# Altium schematic sheet Sheet1.SchDoc
size 594 x 420 mm; SheetNumber: 1; SheetTotal: 1
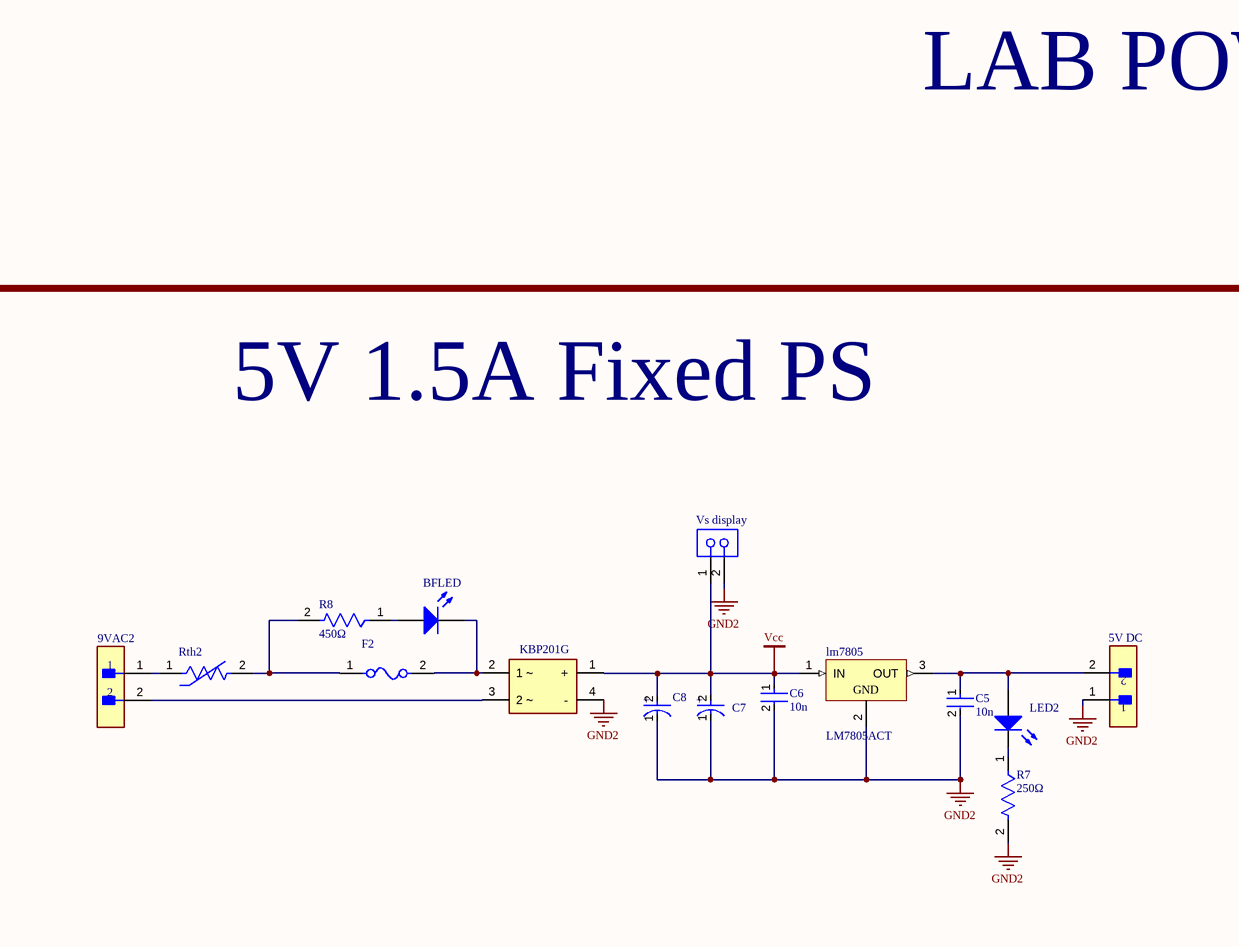
[diagram p0: Sheet1.SchDoc, top left]
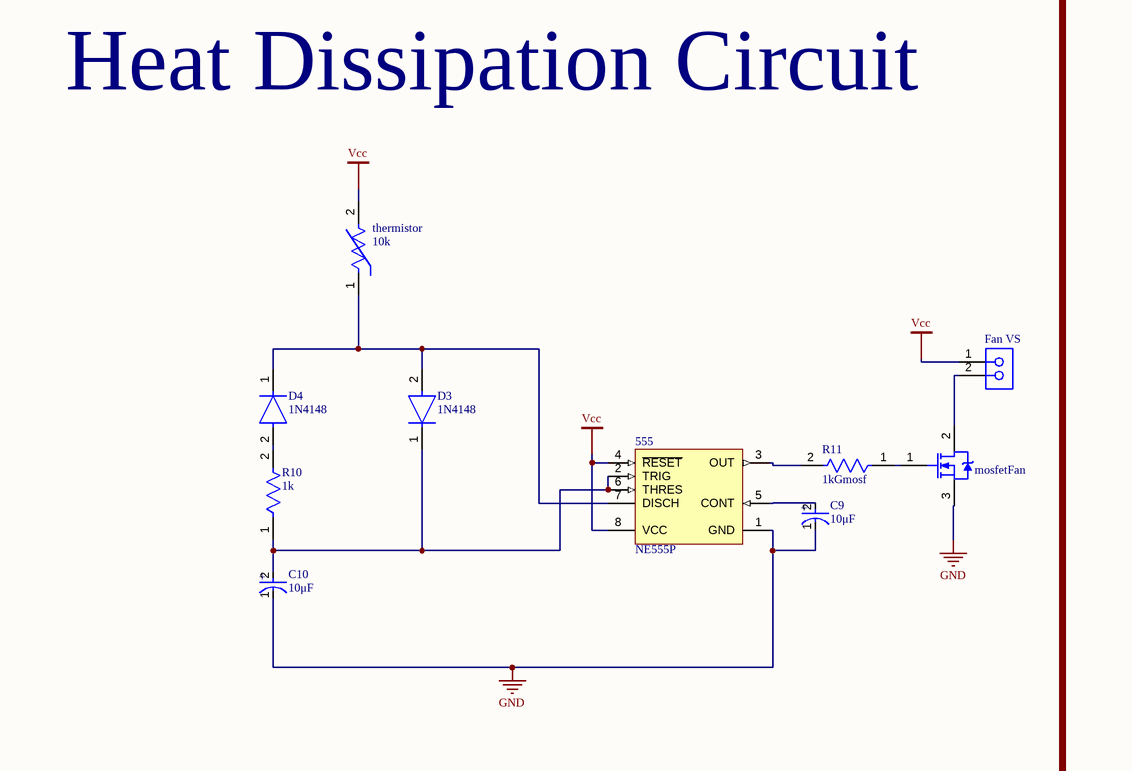
[diagram p1: Sheet1.SchDoc, top right]
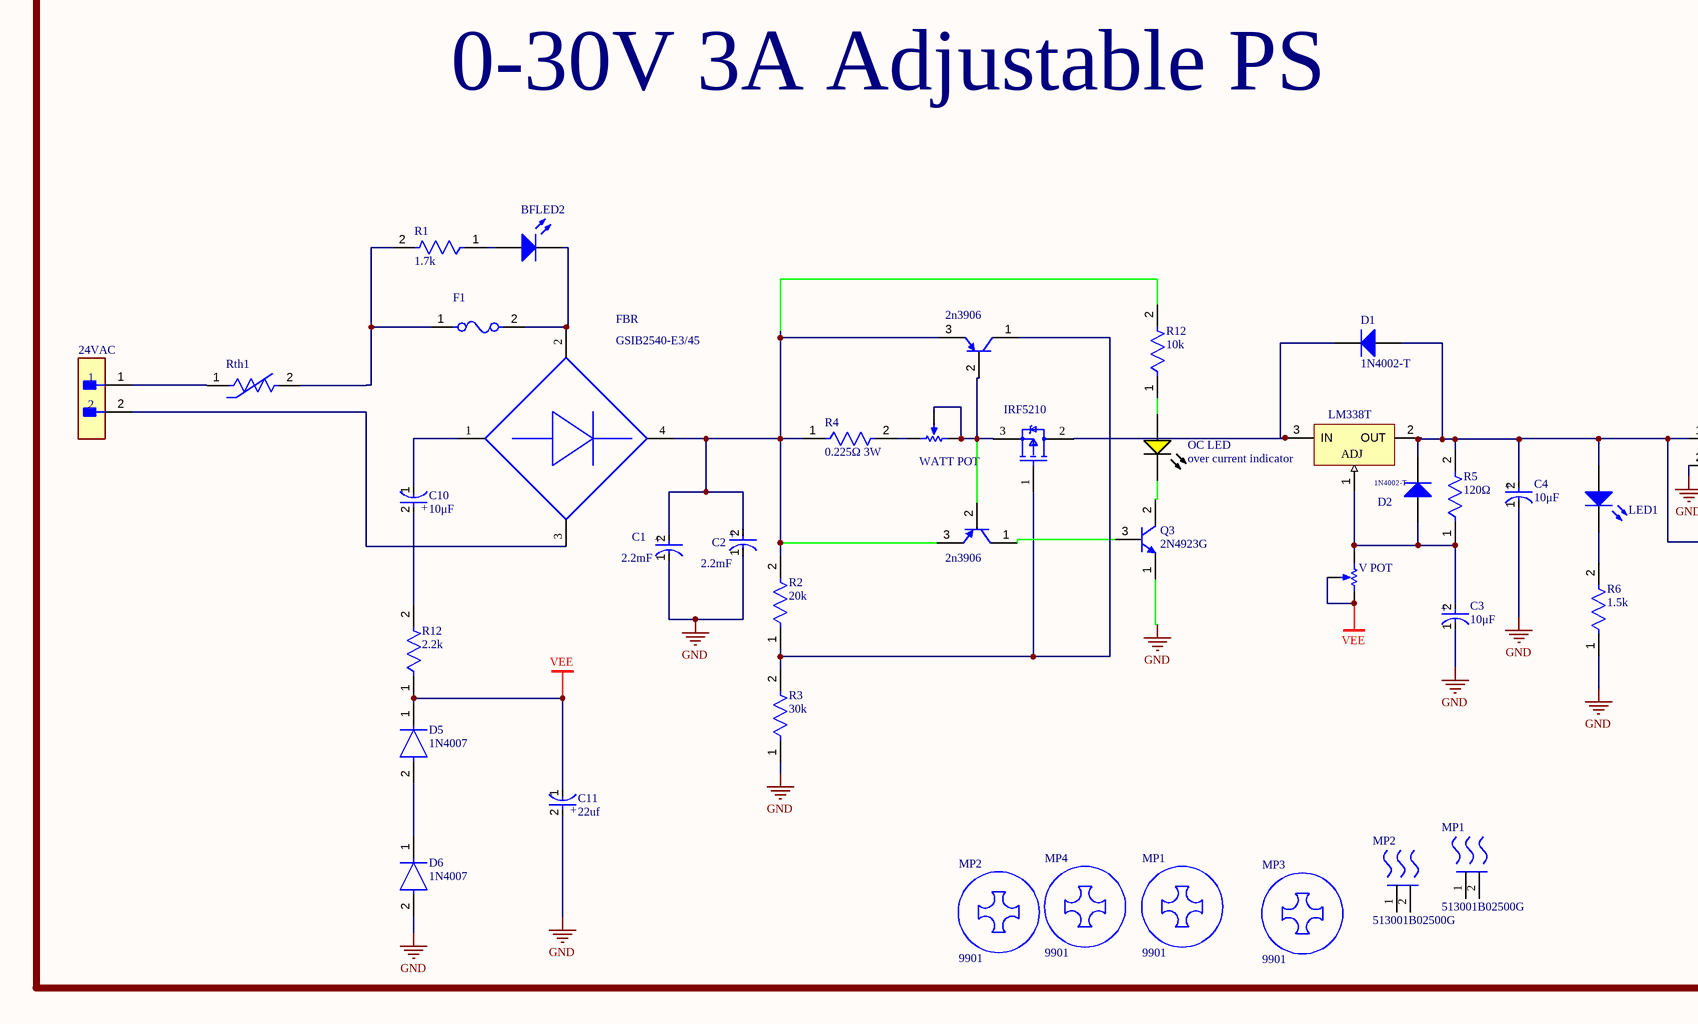
[diagram p2: Sheet1.SchDoc, bottom left]
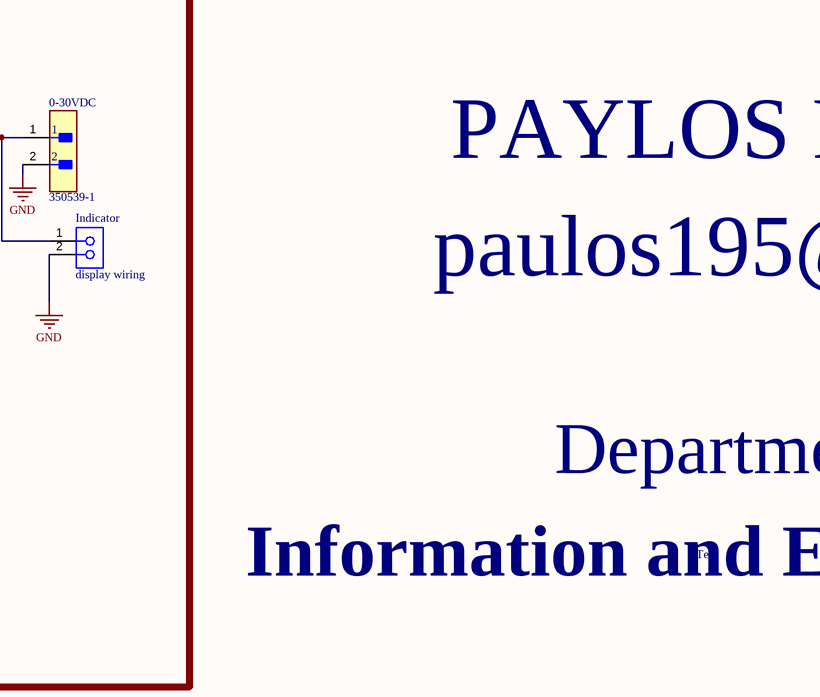
[diagram p3: Sheet1.SchDoc, bottom right]

## Parts
(Parts that share a designator on the sheet are numbered #1, #2 ... from top to bottom, then left to right.)
0-30VDC  350539-1  [FP-350539-1-MFG]
5V_DC  350539-1  [FP-350539-1-MFG]  (value not drawn)
9VAC2  350539-1  [FP-350539-1-MFG]  (value not drawn)
24VAC  350539-1  [FP-350539-1-MFG]  (value not drawn)
555  NE555P  [P0008A]
BFLED  Blowfuse indicator  [Type 3mm]  (value not drawn)
BFLED2  Blown fuse indicator  [Type 3mm]  (value not drawn)
C1  2.2mF  [FP-EGPA500ELL222ML40S-MFG]
C2  2.2mF  [FP-EGPA500ELL222ML40S-MFG]
C3  10μF  [FP-ECA-2CHG010I-MFG]
C4  10μF  [FP-ECA-2CHG010I-MFG]
C5  10n  [FP-RDE0M1-MFG]
C6  10n  [FP-RDE0M1-MFG]
C7  2.2mF  [FP-EGPA500ELL222ML40S-MFG]  (value not drawn)
C8  2.2mF  [FP-EGPA500ELL222ML40S-MFG]  (value not drawn)
C9  10μF  [FP-ECA-2CHG010I-MFG]
C10#1  10μF  [FP-ECA-2CHG010I-MFG]
C10#2  10μF  [FP-ECA-2CHG010I-MFG]
C11  22uf  [FP-RAD-TH-D_5_0_5-L_7_1-F-MFG]
D1  1N4002-T  [DIOD-DO-41-P-2_V]
D2  1N4002-T  [DIOD-DO-41-P-2_V]
D3  1N4148  [FP-017AG-MFG]
D4  1N4148  [FP-017AG-MFG]
D5  1N4007  [FP-1N4007-MFG]
D6  1N4007  [FP-1N4007-MFG]
D?  KBP201G  [FP-KBP-MFG]
F1  64600001223  [FP-64600001223-MFG]  (value not drawn)
F2  64600001223  [FP-64600001223-MFG]  (value not drawn)
Fan_VS  SSQ-102-01-G-S  [SMTC-SSQ-102-01-X-S]  (value not drawn)
FBR  GSIB2540-E3/45  [FP-GSIB2580-E3-45-MFG]
Indicator  display wiring  [SMTC-SSQ-102-01-X-S]
LED1  on indicator  [Type 3mm]  (value not drawn)
LED2  on indicator  [Type 3mm]  (value not drawn)
LM338  LM338T  [NDE0003A]
lm7805  LM7805ACT  [FAIR-TO-220-3]
mosfetCL  IRF5210  [FP-PG-TO262-3-MFG]
mosfetFan  IRF3205PBF  [INF-PG-TO-220AB]  (value not drawn)
MP1#1  513001B02500G  [FP-513001B02500G-MFG]
MP1#2  9901  [FP-9901-MFG]
MP2#1  9901  [FP-9901-MFG]
MP2#2  513001B02500G  [FP-513001B02500G-MFG]
MP3  9901  [FP-9901-MFG]
MP4  9901  [FP-9901-MFG]
OC_LED  over current indicator  [KING-WP7113SYD_V]
Q1  2n3906  [ONSC-TO-92-3-29-11_AM_BL]
Q2  2n3906  [ONSC-TO-92-3-29-11_AM_BL]
Q3  2N4923G  [ONSC-TO-225-3-77-09]
R1  1.7k  [FP-CF14-MFG]
R2  20k  [FP-CF14-MFG]
R3  30k  [FP-CF14-MFG]
R4  0.225Ω 3W  [FP-PAC03-MFG]
R5  120Ω  [FP-CF14-MFG]
R6  1.5k  [FP-CF14-MFG]
R7  250Ω  [FP-CF14-MFG]
R8  450Ω  [FP-CF14-MFG]
R10  1k  [FP-CF14-MFG]
R11  1kGmosf  [FP-CF14-MFG]
R12#1  10k  [FP-CF14-MFG]
R12#2  2.2k  [FP-CF14-MFG]
Rth1  NTPAA5R1LDNB0  [FP-NTPAA-MFG]  (value not drawn)
Rth2  NTPAA5R1LDNB0  [FP-NTPAA-MFG]  (value not drawn)
thermistor  10k  [FP-103AT-2-MFG]
V_POT  2.85k  [BOUR-3852A-282-103AL-3_V]  (value not drawn)
Vs_display  SSQ-102-01-G-S  [SMTC-SSQ-102-01-X-S]  (value not drawn)
WATT_POT  3852A-282-103AL  [BOUR-3852A-282-103AL-3_V]  (value not drawn)

## Blocks framed on the sheet
Heat Dissipation Circuit: 555 C9 C10#1 D3 D4 Fan_VS mosfetFan R10 R11 thermistor
5V 1.5A Fixed PS: 5V_DC 9VAC2 BFLED C5-C8 D? F2 LED2 lm7805 R7 R8 Rth2 Vs_display
0-30V 3A Adjustable PS: 0-30VDC 24VAC BFLED2 C1-C4 C10#2 C11 D1 D2 D5 D6 F1 FBR Indicator LED1 LM338 mosfetCL MP1#1 MP1#2 MP2#1 MP2#2 MP3 MP4 OC_LED Q1-Q3 R1-R6 R12#1 R12#2 Rth1 V_POT WATT_POT

## Nets
GND: 0-30VDC.2 555.1(GND) C1.1(C) C2.1(C) C3.1(C) C4.1(C) C9.1(C) C10#1.1(C) C11.2(A) D6.2(A) Indicator.2 mosfetFan.3(S) Q3.1(E) R3.1 R6.1
GND2: 5V_DC.1 C5.2 C6.2 C7.1(C) C8.1(C) D?.4(-) lm7805.2(GND) R7.2 Vs_display.2
Vcc: 555.4(~{RESET}) 555.8(VCC) C6.1 C7.2(A) C8.2(A) D?.1(+) Fan_VS.1 lm7805.1(IN) thermistor.2 Vs_display.1
VEE: C11.1(C) D5.1(C) R12#2.1 V_POT.2(S) V_POT.3(CW)
Net0-30VDC_1: 0-30VDC.1 C4.2(A) D1.1(A) D2.2(K) Indicator.1 LED1.2(A) LM338.2(OUT) R5.2
Net5V_DC_2: 5V_DC.2 C5.1 LED2.2(A) lm7805.3(OUT)
Net9VAC2_1: 9VAC2.1 Rth2.1
Net9VAC2_2: 9VAC2.2 D?.3(2_~)
Net24VAC_1: 24VAC.1 Rth1.1
Net24VAC_2: 24VAC.2 FBR.3(2_~)
Net555_2: 555.2(TRIG) 555.6(THRES) C10#1.2(A) D3.1(C) R10.1
Net555_3: 555.3(OUT) R11.2
Net555_5: 555.5(CONT) C9.2(A)
Net555_7: 555.7(DISCH) D3.2(A) D4.1(C) thermistor.1
NetBFLED2_1: BFLED2.1(K) F1.2 FBR.2(1_~)
NetBFLED2_2: BFLED2.2(A) R1.1
NetBFLED_1: BFLED.1(K) D?.2(1_~) F2.2
NetBFLED_2: BFLED.2(A) R8.1
NetC1_2: C1.2(A) C2.2(A) FBR.4(-) Q1.3(E) Q2.3(E) R2.2 R4.1 R12#1.2
NetC3_2: C3.2(A) D2.1(A) LM338.1(ADJ) R5.1 V_POT.1(CCW)
NetC10#2_1: C10#2.1(C) FBR.1(+)
NetC10#2_2: C10#2.2(A) R12#2.2
NetD1_2: D1.2(K) LM338.3(IN) mosfetCL.2(Drain)
NetD4_2: D4.2(A) R10.2
NetD5_2: D5.2(A) D6.1(C)
NetF1_1: F1.1 R1.2 Rth1.2
NetF2_1: F2.1 R8.2 Rth2.2
NetFan_VS_2: Fan_VS.2 mosfetFan.2(D)
NetLED1_1: LED1.1(K) R6.2
NetLED2_1: LED2.1(K) R7.1
NetmosfetCL_1: mosfetCL.1(Gate) Q1.1(C) R2.1 R3.2
NetmosfetCL_3: mosfetCL.3(Source) Q1.2(B) Q2.2(B) WATT_POT.1(CCW) WATT_POT.2(S)
NetmosfetFan_1: mosfetFan.1(G) R11.1
NetOC_LED_1: OC_LED.1(A) R12#1.1
NetOC_LED_2: OC_LED.2(K) Q3.2(C)
NetQ2_1: Q2.1(C) Q3.3(B)
NetR4_2: R4.2 WATT_POT.3(CW)

Not connected (* = marked no-connect by the designer): MP1#1 1(MNT_1) 2(MNT_2); MP2#2 1(MNT_1) 2(MNT_2)

## Notes on the sheet
- LAB POWER SUPPLY V2
- PAYLOS POTOLIAS
- paulos195@gmail.com
- Department of
- Information and Electronic Engineering
- Text
- (in symbol CMP-05427-000663-1) +
- (in symbol CMP-05427-002176-1) +
- (in symbol CMP-33768-000005-1) +

## Library data of the parts
0-30VDC 5V_DC 9VAC2 24VAC = CMP-03369-000078-1: CONN HEADER VERT 2POS 5.08MM; Manufacturer: TE Connectivity; Current Rating: 12A; Conn Orientation: Vertical; Number Of Contacts: 2; Conn Gender: Male; Standoff Height: 0.025inch; Voltage Rating: 250V; Category: Conn; Height: 0.41inch; Device Class L3: unset; Number Of Rows: 1; Temperature: -55°C to +105°C; ComponentLink2URL: https://www.te.com/usa-en/product-350539-1.html?te_bu=Cor&te_type=other&te_campaign=oct_glo_cor-oct-global-oth-prtnr-fy19-oct-octo-buy-bom_sma-298_2&elqCampaignId=35216; Manufacturer Part Number: 350539-1; Automotive: No; Mouser Description: Pin & Socket Connectors CONN PCM 2 POS TIN; ComponentLink2Description: Datasheet; Lead Free: Yes; Device Class L1: Connectors; Device Class L2: Headers and Wire Housings; Octopart: https://octopart.com/350539-1-te+connectivity-46510628; Digikey Description: CONN HEADER VERT 2POS 5.08MM; RoHS: TRUE; Temperature Range Low: -55°C; Package: 350539-1; Temperature Range High: +105°C; Contact Material: Gold,Nickel; Pitch: 5.08mm
555 = CMP-2000-04954-1: Precision Timer, 4.5 to 16 V, 0 to 70 degC, 8-Pin DIP, Pb-Free, Tube; Manufacturer: TexasInstruments; Maximum High Level Output Current: -200mA; Number of Internal Timers: 1; Operating Supply Voltage: 5; Maximum Low Level Output Current: 200mA; Rad Hard: No; Packaging: Rail/Tube; Manufacturer URL: http://www.ti.com/; Package Reference: P8; Package Description: 8-Pin Double In-line Package, Body 9.59 x 6.35 mm, Pitch 2.54 mm; Package URL: http://www.ti.com/lit/ml/mpdi001b/mpdi001b.pdf; Type: Standard; Datasheet URL: http://www.ti.com/general/docs/lit/getliterature.tsp?genericPartNumber=NE555&fileType=pdf; Category: Timer; Package: 8PDIP; Datasheet Version: Rev. I, 09/2014
BFLED BFLED2 = CMP-1488-00005-1: THT LED round mono-color color lens, WL-TMRW, Super Red; PartNumber: 151031SS04000; Manufacturer: Wuerth Elektronik; ComponentLink2Description: Datasheet; ComponentLink1URL: http://www.we-online.com; ComponentLink1Description: Manufacturer URL; PackageReference: Type 3mm; ComponentLink2URL: http://katalog.we-online.de/pbs/datasheet/7448042001.pdfhttp://katalog.we-online.de/pbs/datasheet/7448042001.pdfhttp://katalog.we-online.de/pbs/datasheet/7448042001.pdfhttp://katalog.we-online.de/pbs/datasheet/151031SS04000.pdf; Emitting color: Super Red
C1 C2 C7 C8 = CMP-33768-000005-1: CAP ALUM 2200UF 20% 50V RADIAL; Life (Hours): 5000Hour; Ripple Current: 3.72A; Lead Diameter: 0.8mm; Leakage Current: 4uA; ESR (Equivalent Series Resistance): 20mR; Polarity: Polar; Mount: Through Hole; Packaging: Bulk; Case/Package: Radial; Length: 40mm; Voltage Rating (DC): 50V; Capacitance: 2.2mF; Termination: Radial; Voltage Rating: 50V; Min Operating Temperature: -40°C; Max Operating Temperature: 125°C; Number of Pins: 40; Lead Free: Lead Free; Radiation Hardening: No; Lead Pitch: 7.5mm; Voltage: 50V; Tolerance: 20%; Package Quantity: 250; Height - Seated (Max): 1.634inch; Diameter: 16mm
C3 C4 C9 C10#1 C10#2 = CMP-05427-002176-1: CAP ALUM 1UF 20% 160V RADIAL; Lead/Base Style: Straight; Ripple Current: 17mA; Life (Hours): 2000Hour; Voltage Rating (DC): 160V; Max Operating Temperature: 105°C; Radiation Hardening: No; Min Operating Temperature: -25°C; Packaging: Ammo Pack; Series: NHG; Capacitance: 1uF; Height - Seated (Max): 0.48inch; Lead Pitch: 2.5mm; Diameter: 6.3mm; Length: 11.2mm; Package Quantity: 2000; Termination: Radial; RoHS Compliant: Yes; Voltage Rating: 160V; Tolerance: 20%; Height: 11.2mm; Case/Package: Radial; Mount: Through Hole
C5 C6 = CMP-06035-051680-1: Ceramic Capacitor 100nF ±10% 50V X7R Radial; Lead/Base Style: Kinked; Lead Diameter: 0.5mm; Lead Free: Lead Free; Mount: Through Hole; Package Quantity: 2000; Lead Pitch: 0.197inch; Capacitance: 100nF; Case/Package: Radial; Tolerance: 10%; Height - Seated (Max): 0.236inch; Max Operating Temperature: 125°C; Dielectric: X7R; Min Operating Temperature: -55°C; Voltage Rating (DC): 50V; Voltage Rating: 50V; Termination: Radial; Height: 3.5mm; Resistor Type: Ceramic; Width: 3.5mm; Packaging: Tape and Reel; Length: 0.157inch
C11 = CMP-05427-000663-1: Aluminum Electrolytic Capacitors (Radial Lead Type) 33uF ±20% 10V; Ripple Current (AC): 50mA; Life (Hours): 1000Hour; Leakage Current: 3.3uA; Series: GA; Package Quantity: 200; Tolerance: 20%; Height: 7mm; Radiation Hardening: No; Height - Seated (Max): 0.276inch; Max Operating Temperature: 105°C; Construction: RADIAL; Case/Package: Radial; REACH SVHC: No SVHC; Voltage: 10V; Voltage Rating: 10V; Diameter: 5mm; Mount: Through Hole; Inductance Tolerance: 20%; Capacitance: 33uF; Lead Pitch: 2mm; Packaging: Bulk; RoHS Compliant: Yes; Min Operating Temperature: -55°C; Ripple Current: 50mA; Voltage Rating (DC): 10V; Length: 7mm; Termination: Radial
D1 D2 = CMP-0639-00002-2: 1.0 A Rectifier, 15 pF, 100 V, -65 to 150 degC, 2-Pin DO-41 Plastic, RoHS, Tape and Reel; Manufacturer: Diodes Inc; Max. Average Rectified Current IO (A): 1; Max. IFSM (A): 30; CT (pF): 15; Max. IR (uA): 5; VRRM (V): 100; DatasheetVersion: Rev. 8-2; ComponentLink2Description: Datasheet; PartNumber: 1N4002-T; ComponentLink2URL: http://diodes.com/datasheets/ds28002.pdf; PackageDescription: 2-Pin Axial Lead, Body 4.635 x 2.36 mm, Lead Spread 25.4 mm; ComponentLink1Description: Manufacturer URL; RoHS: TRUE; Mounting Technology: Through Hole; Packing: Tape and Reel; Operating Temperature Range (degC): -65 to 150; VF (V): 1; ComponentLink1URL: http://diodes.com/; PackageReference: DO-41-P-2
D3 D4 = CMP-07163-000046-1: DIODE GEN PURP 100V 200MA DO35; Forward Voltage: 1V; Max Power Dissipation: 500mW; Max Reverse Current: 5uA; Forward Current: 300mA; Current: 4A; Reverse Recovery Time: 4ns; Element Configuration: Single; Outside Diameter: 1.85mm; Capacitance: 4pF; Polarity: Standard; Max Forward Surge Current (Ifsm): 1A; Reverse Voltage: 100V; Output Current: 200mA; Average Rectified Current: 200mA; Diameter: 1.91mm; Max Repetitive Reverse Voltage (Vrrm): 100V; Current Rating: 200mA; Case/Package: DO-35; Lead Free: Lead Free; Number of Pins: 2; Recovery Time: 4ns; Packaging: Bulk; Contact Plating: Tin; Voltage: 100V; Mount: Through Hole; Max Surge Current: 4A; Package Quantity: 2000; Width: 1.91mm; Max Reverse Voltage (DC): 100V; Length: 4.56mm; Radiation Hardening: No; Power Dissipation: 500mW; Voltage Rating (DC): 100V; Peak Non-Repetitive Surge Current: 4A; REACH SVHC: No SVHC; Height: 4.56mm; Max Operating Temperature: 175°C; Series: -; Weight: 0.01lb; Min Operating Temperature: -65°C
D5 D6 = CMP-123542-000001-1: Rectifier diode 1000 V 1 A DO-41, ,; Manufacturer: Diotec; Max Surge Forward Current: 27A; Forward Current: 1A; Max Junction Temp: +175°C; Reverse Voltage: 1000V; Value: 15pF; Peak Reverse Current: 5uA; Category: Diode; Temperature Range Low: -50°C; Automotive: No; Temperature: -50°C to +175°C; Lead Free: Yes; ComponentLink2Description: Datasheet; Max Repetitive Reverse Voltage: 1000V; ComponentLink2URL: https://datasheet.octopart.com/1N4007-Diotec-datasheet-62346875.pdf; Manufacturer Part Number: 1N4007; Device Class L3: Rectifier Diodes; Height: 2.8mm; Octopart: https://octopart.com/1n4007-diotec-4040411; Package: 1N4007; Temperature Range High: +175°C; Device Class L1: Discrete Semiconductors; Device Class L2: Diodes; RoHS: TRUE; Capacitance: 15pF; Ipc Land Pattern Name: DIOAD888W100L520D280
D? = CMP-12791-000035-1: BRIDGE RECT 1PHASE 600V 2A KBP; Manufacturer: Diodes Inc.; Manufacturer Part Number: KBP206G; Capacitance: 25pF; Max Junction Temp: +150°C; Value: 25pF; Max Surge Forward Current: 65A; Peak Reverse Current: 5uA; Standoff Height: 1.8mm; Octopart: https://octopart.com/kbp206g-diodes+inc.-330175; Footprint Url: https://www.diodes.com/assets/Package-Files/KBP.pdf; Device Class L2: Diodes; Category: Diode; Reverse Voltage: 600V; Device Class L3: Rectifier Diodes; Height: 12.8mm; Device Class L1: Discrete Semiconductors; Mouser Description: Bridge Rectifiers 2.0A 600V; ComponentLink2Description: Datasheet; Forward Current: 2A; Automotive: No; RoHS: TRUE; Temperature Range High: +150°C; ComponentLink2URL: https://www.diodes.com/assets/Datasheets/ds21205.pdf; Digikey Description: BRIDGE RECT 1PHASE 600V 2A KBP; Temperature: -65°C to +150°C; Temperature Range Low: -65°C; Package: KBP; Max Repetitive Reverse Voltage: 600V; Lead Free: Yes
F1 F2 = CMP-08604-000020-1: FUSE BLOCK CART 250V 6.3A PCB; Manufacturer: Littelfuse Inc; Number Of Fuses: 1; Conn Orientation: Horizontal; ComponentLink2URL: https://www.littelfuse.com/~/media/electronics/datasheets/fuse_blocks/littelfuse_fuse_block_646_datasheet.pdf.pdf; Manufacturer Part Number: 64600001223; Mouser Description: Fuse Holder Screw Mount Bulk; Voltage Rating Ac: 250V; Voltage Rating Dc: 250V; Category: Fuse; Fuse Current: 6.3A; Octopart: https://octopart.com/64600001223-littelfuse-39645661; Package: 0; Automotive: No; Height: 12mm; Device Class L3: unset; ComponentLink2Description: Datasheet; Digikey Description: FUSE BLOCK CART 250V 6.3A PCB; Device Class L1: Circuit Protection; Lead Free: Yes; Device Class L2: Fuse Holders; RoHS: TRUE
Fan_VS Vs_display = CMP-1023-00275-1: SQ Post Socket, Through-hole, Vertical, -55 to 125 degC, 2.54 mm Pitch, 2-Pin, Female, RoHS; Manufacturer: Samtec; Pitch: 2.54 mm; ComponentLink1URL: http://www.samtec.com; ComponentLink3URL: http://www.samtec.com/documents/webfiles/cpdf/SSQ-1XX-XX-XXX-X-XX-XXX-XX-X-MKT.pdf; Temperature Range: -55 to 125 degC; PackageDescription: Assembly, Socket Strip .025[0.64] SQ Tail; RoHS: True; PackageVersion: BD, 6/1987; ComponentLink3Description: Package Specification; PackageReference: SSQ-102-01-X-S; ComponentLink2Description: Datasheet; ComponentLink2URL: http://www.samtec.com/documents/webfiles/pdf/SSQ_TH.PDF; ComponentLink1Description: Manufacturer URL; DatasheetVersion: F-214; Orientation: Vertical; Mounting Technology: Through-hole; PartNumber: SSQ-102-01-G-S
FBR = CMP-02540-000115-1: BRIDGE RECT 1P 800V 3.5A GSIB-5S; Current: 25A; Peak Non-Repetitive Surge Current: 350A; Forward Voltage: 1V; Current Rating: 20A; Element Configuration: Single; Max Reverse Current: 10uA; Number of Elements: 1; Voltage: 200V; Average Rectified Current: 3.5A; Package Quantity: 20; Radiation Hardening: No; Width: 4.6mm; Number of Pins: 4; Height: 20mm; Forward Current: 3.5A; Max Surge Current: 350A; Min Operating Temperature: -55°C; Max Forward Surge Current (Ifsm): 350A; Lead Free: Lead Free; Max Repetitive Reverse Voltage (Vrrm): 800V; Case/Package: SIP; Length: 30mm; RoHS Compliant: Yes; Packaging: Rail/Tube; Max Operating Temperature: 150°C; Max Reverse Leakage Current: 10uA; Series: -; Mount: Through Hole
Indicator = CMP-1023-00275-1: SQ Post Socket, Through-hole, Vertical, -55 to 125 degC, 2.54 mm Pitch, 2-Pin, Female, RoHS; PartNumber: SSQ-102-01-G-S; Manufacturer: Samtec; Pitch: 2.54 mm; ComponentLink1URL: http://www.samtec.com; ComponentLink3URL: http://www.samtec.com/documents/webfiles/cpdf/SSQ-1XX-XX-XXX-X-XX-XXX-XX-X-MKT.pdf; Temperature Range: -55 to 125 degC; PackageDescription: Assembly, Socket Strip .025[0.64] SQ Tail; RoHS: True; PackageVersion: BD, 6/1987; ComponentLink3Description: Package Specification; PackageReference: SSQ-102-01-X-S; ComponentLink2Description: Datasheet; ComponentLink2URL: http://www.samtec.com/documents/webfiles/pdf/SSQ_TH.PDF; ComponentLink1Description: Manufacturer URL; DatasheetVersion: F-214; Orientation: Vertical; Mounting Technology: Through-hole
LED1 LED2 = CMP-1488-00004-1: THT LED round mono-color color lens, WL-TMRC , Bright Green; PartNumber: 151031VS06000; Manufacturer: Wuerth Elektronik; ComponentLink2Description: Datasheet; ComponentLink1URL: http://www.we-online.com; ComponentLink2URL: http://katalog.we-online.de/pbs/datasheet/7448042001.pdfhttp://katalog.we-online.de/pbs/datasheet/7448042001.pdfhttp://katalog.we-online.de/pbs/datasheet/7448042001.pdfhttp://katalog.we-online.de/pbs/datasheet/151031VS06000.pdf; ComponentLink1Description: Manufacturer URL; Emitting color: Bright Green; PackageReference: Type 3mm
LM338 = CMP-0062-02474-3: 5 Amp Adjustable Regulator, 3-pin TO-220, Pb-Free; Manufacturer: Texas Instruments; PackageTopMarking: NSUZXYTTE#*LM338T P+; CompType: LDO IC; PowerWise: N; ComponentLink1URL: http://www.ti.com/general/docs/lit/getliterature.tsp?genericPartNumber=LM338&fileType=pdf; ComponentLink1Description: Datasheet URL; RoHS: Y; PinCount: 3; PackageReference: NDE0003A; PackageDescription: TO-220, Molded, 3 Lead, Straight
lm7805 = CMP-2000-04937-1: Positive Voltage Regulator, 5 V, 1 A, 0 to 125 degC, 3-Pin TO-220, RoHS, Tube; Manufacturer: Fairchild; Number of Outputs: 1; Typical Dropout Voltage @ Current: 2V@1A; Output Type: Fixed; Output Voltage: 5V; Quiescent Current: 6mA; Dropout Voltage Measurement Current: 1A; Line Regulation: 50mV; Maximum Input Voltage: 35V; Regulator Function: Linear; Load Regulation: 100mV; Package Type: TO-220; Mounting Type: ThroughHole; Height: 16.51mm; Maximum Operating Temperature: +125degC; Datasheet Version: Rev. 1.0.1, 05/2006; Package Reference: TO-220; Minimum Operating Temperature: 0degC; Manufacturer URL: https://www.fairchildsemi.com/; Package URL: https://www.fairchildsemi.com/package-drawings/TO/TO220B03.pdf; Length: 10.67mm; Series: LM78xx; Dimensions: 10.67x4.83x16.51mm; Polarity: Positive; Maximum Output Current: 1A; Pin Count: 3; Width: 4.83mm; Package Description: 3-Pin Through Hole Device, Body 10 x 4.5 mm, Pitch 2.54 mm; Datasheet URL: https://datasheet.ciiva.com/5816/1359194-5816420.pdf
mosfetCL = CMP-32901-001325-1: MOSFET P-CH 100V 38A TO262; Max Dual Supply Voltage: -100V; Turn-Off Delay Time: 72ns; Drain to Source Resistance: 60mR; Threshold Voltage: 4V; Input Capacitance: 2.78nF; Max Power Dissipation: 3.1W; Power Dissipation: 170W; Turn-On Delay Time: 14ns; Gate to Source Voltage (Vgs): 20V; Polarization: P; Reach SVHC Compliant: Yes; Width: 0.19inch; Series: HEXFET®; Halogen Free: Halogen Free; Length: 0.42inch; Max Operating Temperature: 150°C; Continuous Drain Current (ID): 38A; Lead Free: Contains Lead; Number of Pins: 3; Min Operating Temperature: -55°C; Drain to Source Breakdown Voltage: -100V; Rds On Max: 60mR; Packaging: Rail/Tube; Mount: Through Hole; RoHS Compliant: Yes; Height: 0.38inch; Drain to Source Voltage (Vdss): -100V; Case/Package: TO-262
mosfetFan = CMP-2000-04997-1: HEXFET(R) Power N-Channel MOSFET, 55 V, 110 A, -55 to 117 degC, 3-Pin TO-220AB, RoHS, Rail/Tube; Manufacturer: International Rectifier; Typical Gate Charge @ Vgs: 146nC@10V; Maximum Gate Source Voltage: ±20V; Maximum Continuous Drain Current: 110A; Typical Input Capacitance @ Vds: 3247pF@25V; Channel Type: N; Minimum Gate Threshold Voltage: 2V; Number of Elements per Chip: 1; Transistor Configuration: Single; Transistor Material: Si; Maximum Drain Source Voltage: 55V; Maximum Gate Threshold Voltage: 4V; Typical Turn-Off Delay Time: 50ns; Typical Turn-On Delay Time: 14ns; Channel Mode: Enhancement; Maximum Drain Source Resistance: 0.008Ω; Maximum Power Dissipation: 200W; Package Version: Feb-04; Package Type: TO-220AB; Width: 4.69mm; Dimensions: 10.54x4.69x8.77mm; Category: PowerMOSFET; Package URL: http://www.infineon.com/dgdl/bts110.pdf?folderId=db3a304412b407950112b43583c16310&fileId=db3a304412b407950112b43584326311&sId=db3a30443e3c704d013e4eb6657a2604; Package Description: 3-Pin Plastic (Green) Transistor Single Outline Package, 9.9 x 9.2 mm Body, 2.54 mm Pitch; Package Reference: PG-TO-220AB; Length: 10.54mm; Height: 8.77mm; Datasheet Version: Jul-10; Minimum Operating Temperature: -55degC; Manufacturer URL: http://internationalrectifier.com/; Datasheet URL: http://datasheet.octopart.com/IRF3205PBF-International-Rectifier-datasheet-10898897.pdf; Maximum Operating Temperature: +175degC; Pin Count: 3; Mounting Type: ThroughHole
MP1#1 MP2#2 = CMP-69313-000004-1: BOARD LEVEL HEAT SINK; Finish: Anodized; Natural Thermal Resistance: 13.4°C/W; Thermal Resistance @ Forced Air Flow (100 LFM): 4°C/W; Shape: Fins; Height: 25.4mm; Height Off Base: 0.5inch; Package Quantity: 250; Mount: Bolt; Case/Package: TO-218; Width: 1.375inch; RoHS Compliant: Yes; Type: Passive; Lead Free: Lead Free; Color: Black; Material: Aluminium; Length: 34.92mm; Depth: 12.7mm
MP1#2 MP2#1 MP3 MP4 = CMP-19664-000002-1: MACHINE SCREW PAN PHILLIPS 4-40; Head Height: 0.065inch; Thread Size: #4-40; Outside Diameter: 0.212inch; Material: Stainless Steel; Lead Free: Lead Free; Series: -; Package Quantity: 100; Length: 0.44inch; Mount: Screw
OC_LED = CMP-1757-00003-1: The Super Bright Yellow Device, 2 V, -40 to 85 degC, 2-Pin THD, RoHS, Tape and Reel; Tolerance: 1%; Power Rating: 250 mW; Voltage Rating: 250 V; Resistance: 22.1 kohm; Case\Package: Axial; Length: 0.248 inch; Max Operating Temperature: 155 degC; PackageDescription: 2-Pin Through Hole Device, Dia 5.9 mm, Body Length 8.6 mm; Package Quantity: 200; ComponentLink1Description: Datasheet; Mount: Through Hole; DatasheetVersion: Rev. 7B, 01/2015; RoHSCompliant: true; PackageReference: WP7113SYD; ComponentLink1URL: http://www.kingbrightusa.com/images/catalog/SPEC/WP7113SYD.pdf; Packaging: Bulk; Min Operating Temperature: -55 degC
Q1 = CMP-1048-01520-1: Amplifier Transistor, PNP Silicon, 3-Pin TO-92, Pb-Free, Tape and Reel BC557BRL1G; Manufacturer: On Semiconductor; IC Continuous (A): -0.1; Polarity: PNP; ComponentLink2URL: http://www.onsemi.com/pub_link/Collateral/BC556B-D.PDF; ComponentLink3URL: http://www.onsemi.com/pub_link/Collateral/MAC97-D.PDF; Mounting Technology: Through Hole; RoHS: TRUE; PartNumber: BC557BRL1G; DatasheetVersion: Rev. 3; PackageReference: TO-92-3-29-11_AM_BL; PackageVersion: Rev. AM; PackageDescription: 3-Pin Transistor Outline, Body 4.825 x 3.685 mm, Pitch 1.27 mm; ComponentLink1URL: http://www.onsemi.com/; ComponentLink1Description: Manufacturer URL; Packing: Tape and Reel; ComponentLink2Description: Datasheet; ComponentLink3Description: Package Specification
Q2 = CMP-1048-01520-1: Amplifier Transistor, PNP Silicon, 3-Pin TO-92, Pb-Free, Tape and Reel; Manufacturer: On Semiconductor; PartNumber: BC557BRL1G; IC Continuous (A): -0.1; Polarity: PNP; ComponentLink2URL: http://www.onsemi.com/pub_link/Collateral/BC556B-D.PDF; ComponentLink3URL: http://www.onsemi.com/pub_link/Collateral/MAC97-D.PDF; Mounting Technology: Through Hole; RoHS: TRUE; DatasheetVersion: Rev. 3; PackageReference: TO-92-3-29-11_AM_BL; PackageVersion: Rev. AM; PackageDescription: 3-Pin Transistor Outline, Body 4.825 x 3.685 mm, Pitch 1.27 mm; ComponentLink1URL: http://www.onsemi.com/; ComponentLink1Description: Manufacturer URL; Packing: Tape and Reel; ComponentLink2Description: Datasheet; ComponentLink3Description: Package Specification
Q3 = CMP-1048-01247-1: Medium-Power Plastic NPN Silicon Transistor, 3-Pin TO-225, Pb-Free, Bulk Box; Manufacturer: On Semiconductor; fT Min (MHz): 3; IC Continuous (A): 1; PartNumber: 2N4923G; DatasheetVersion: Rev. 14; Mounting Technology: Through Hole; ComponentLink3URL: http://www.onsemi.com/pub_link/Collateral/77-09.PDF; PackageDescription: 3-Pin Flange Mount, Vertical Straight Lead, Body 7.6 x 2.7 mm, Pitch 2.29 mm; Polarity: NPN; Packing: Bulk Box; ComponentLink2Description: Datasheet; RoHS: TRUE; PackageReference: TO-225-3-77-09; PackageVersion: Rev. AC, 12/2013; ComponentLink1URL: http://www.onsemi.com/; ComponentLink1Description: Manufacturer URL; ComponentLink3Description: Package Specification; ComponentLink2URL: http://www.onsemi.com/pub_link/Collateral/2N4921-D.PDF
R1-R3 R5-R8 R10 R11 R12#1 R12#2 = CMP-26528-000003-1: RES 7.5K OHM 1/4W 5% AXIAL; Max Power Dissipation: 250mW; Temperature Coefficient: -400ppm/°C; Resistance: 7.5kR; RoHS Compliant: Yes; Lead Free: Lead Free; Max Operating Temperature: 155°C; Case/Package: Axial; Tolerance: 5%; Power Rating: 250mW; Diameter: 2.3mm; Features: Flame Retardant Coating; Series: CF; Resistor Type: Carbon Film; Number of Terminations: 2; Length: 0.256inch; Min Operating Temperature: -55°C; Contact Plating: Tin; Packaging: Tape and Reel; Mount: Through Hole; Radiation Hardening: No
R4 = CMP-02408-000023-1: RES 560 OHM 3W 1% AXIAL; Temperature Coefficient: 100ppm/°C; Resistance: 560R; Case/Package: Axial; Contact Plating: Tin; Power Rating: 3W; Max Operating Temperature: 275°C; RoHS Compliant: Yes; Max Power Dissipation: 3W; Series: PAC; Packaging: Cut Tape; Diameter: 5.5mm; Resistor Type: Wirewound; Features: Flame Retardant Coating; Mount: Through Hole; Length: 0.65inch; Package Quantity: 1; Number of Terminations: 2; Radiation Hardening: No; Min Operating Temperature: -55°C; Tolerance: 1%
Rth1 Rth2 = CMP-06022-000035-1: ICL 5.1 OHM 15% 2.5A 10MM; Lead Diameter: 0.8mm; Resistance: 5.1R; Voltage: 264V; Case/Package: Radial; Width: 5mm; Package Quantity: 100; Current Rating: 2.5A; Depth: 5mm; Lead Pitch: 0.295inch; Packaging: Bulk; Tolerance: 15%; Min Operating Temperature: -20°C; Mount: Through Hole; Lead Free: Lead Free; Diameter: 0.394inch; Thickness: 5mm; Number of Pins: 2; Radiation Hardening: No; Max Operating Temperature: 160°C
thermistor = CMP-2000-05824-2: Thermistor NTC 10KOhm 1% 2-Pin; Resistance: 10kR; Lead Pitch: 2.54mm; Height: 2.4mm; Max Operating Temperature: 110°C; Width: 3.7mm; RoHS Compliant: Yes; Min Operating Temperature: -50°C; Termination: Radial; Packaging: Bulk; Number of Pins: 2; Series: AT; Tolerance: 1%; Length: 17mm
V_POT WATT_POT = CMP-2000-05079-1: Diameter Panel Control, 10 KOhm, +/- 10%, 2 W, -1 to 125 degC, 3-Pin THD, RoHS, Bulk; Manufacturer: Bourns; Temperature Coefficient: ±150ppm/degC; Number of Gangs: 1; Other Names: 3852A282103AL; Actuator Length: 0.875"(22.23mm); Resistive Material: Cermet; PCN Design/Specification: PBTResinJun/2011; Rotation: 280deg; PCN Other: MultipleChanges01/Dec/2012; Catalog Drawings: 3852SeriesSide1 / 3852SeriesSide2; Online Catalog: 3852and3856Series; Associated Product: 36-8560-ND / -KNOBINSTRUMW/DIALRND.9"DIA / 36-8555-ND / -KNOBINSTRUMSKIRTEDRND.7"DIA / 36-8556-ND / -KNOBINSTRUMSKIRTEDRND.9"DIA / 36-8565-ND / -KNOBINSTRUMDBLBARRND.7"DIA / 36-8566-ND / -KNOBINSTRUMDBLBARRND.9"DIA / 36-8568-ND / -KNOBINSTRUMSGLBARRND.7"DIA / 36-8569-ND / -KNOBINSTRUMSGLBARRND.9"DIA / 36-8559-ND / -KNOBINSTRUMW/DIALRND.7"DIA / 226-1006-ND / -KNOBBLKGLOSS.75"DIA.250"SHAFT / 226-1007-ND / -KNOBBLKGLOSS.925"DIA.250"SHAFT / 226-1011-ND / -KNOBBLKGLOS; Actuator Diameter: 0.250"(6.35mm); Built in Switch: None; Resistance (Ohms): 10k; Power (Watts): 2W; Actuator Type: Slotted; Standard Package: 45; Tolerance: ±10%; Taper: Linear; Series: 3852; Packaging: Bulk; Category: Potentiometers,VariableResistors; Bushing Thread: 3/8-32; Datasheet URL: https://datasheet.ciiva.com/11831/0900766b80f93b4b-11831016.pdf; Datasheet Version: Sep-14; Number of Turns: 1; Family: RotaryPotentiometers,Rheostats; Termination Style: SolderLug; RoHS Information: 3852A-LMaterialDeclaration; Mounting Type: PanelMount; Manufacturer URL: http://www.bourns.com/